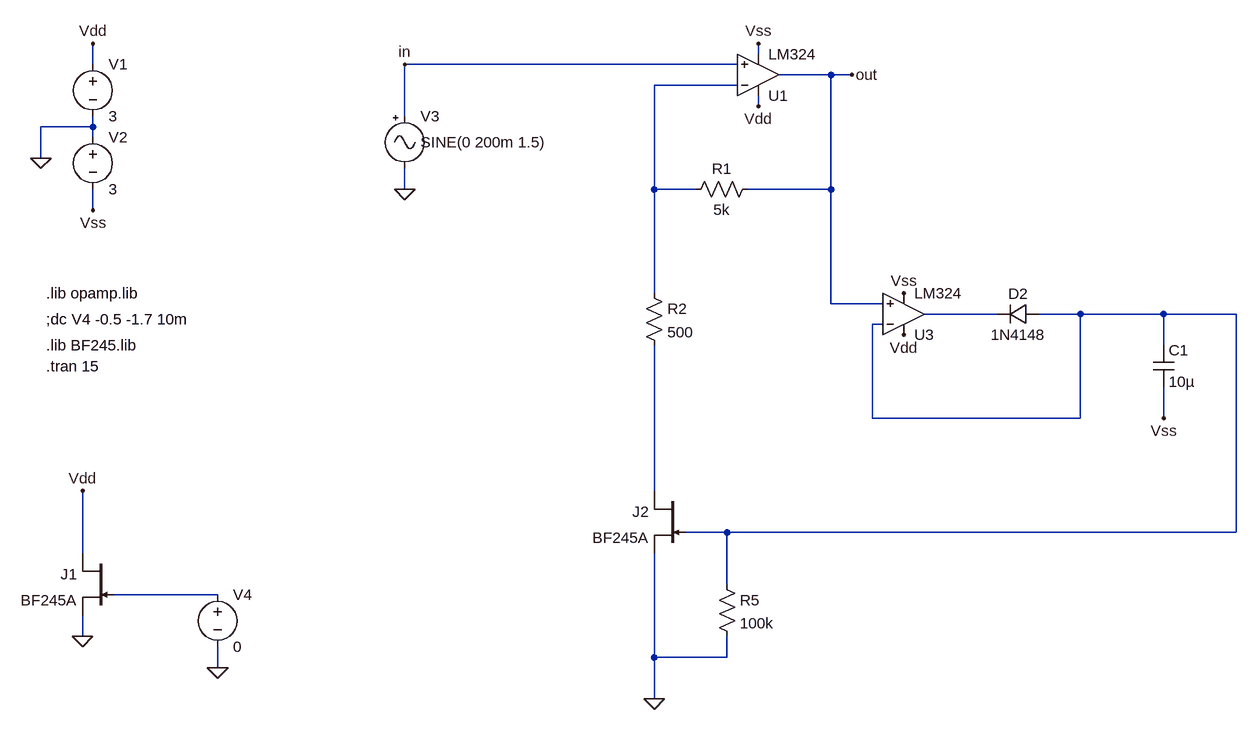
[diagram p0: schematic agc.asc]
agc.asc, the LTspice schematic file:
Version 4
SHEET 1 1464 940
WIRE 224 -176 224 -192
WIRE -800 -160 -800 -192
WIRE 192 -160 -320 -160
WIRE 336 -144 256 -144
WIRE 368 -144 336 -144
WIRE 192 -128 64 -128
WIRE 224 -96 224 -112
WIRE -320 -80 -320 -160
WIRE -800 -64 -800 -80
WIRE -800 -64 -880 -64
WIRE -800 -48 -800 -64
WIRE -880 -16 -880 -64
WIRE -320 32 -320 0
WIRE 64 32 64 -128
WIRE 128 32 64 32
WIRE 336 32 336 -144
WIRE 336 32 208 32
WIRE -800 64 -800 32
WIRE 64 192 64 32
WIRE 336 208 336 32
WIRE 416 208 336 208
WIRE 592 224 480 224
WIRE 720 224 656 224
WIRE 848 224 720 224
WIRE 960 224 848 224
WIRE 416 240 400 240
WIRE 848 272 848 224
WIRE 400 384 400 240
WIRE 720 384 720 224
WIRE 720 384 400 384
WIRE 848 384 848 336
WIRE 64 496 64 272
WIRE 176 560 112 560
WIRE 960 560 960 224
WIRE 960 560 176 560
WIRE -816 592 -816 496
WIRE 176 640 176 560
WIRE -608 656 -768 656
WIRE -816 720 -816 688
WIRE 64 752 64 592
WIRE 176 752 176 720
WIRE 176 752 64 752
WIRE -608 768 -608 736
WIRE 64 816 64 752
FLAG -880 -16 0
FLAG -800 -192 Vdd
FLAG 224 -96 Vdd
FLAG 224 -192 Vss
FLAG -800 64 Vss
FLAG -320 32 0
FLAG 368 -144 out
FLAG -320 -160 in
FLAG -816 720 0
FLAG -816 496 Vdd
FLAG -608 768 0
FLAG 448 192 Vss
FLAG 448 256 Vdd
FLAG 848 384 Vss
FLAG 64 816 0
SYMBOL voltage -800 -176 R0
SYMATTR InstName V1
SYMATTR Value 3
SYMBOL voltage -800 -64 R0
SYMATTR InstName V2
SYMATTR Value 3
SYMBOL Misc\\signal -320 -96 R0
WINDOW 123 24 144 Left 2
WINDOW 39 0 0 Left 2
WINDOW 3 24 56 Left 2
SYMATTR Value SINE(0 200m 1.5)
SYMATTR InstName V3
SYMBOL res 224 16 R90
WINDOW 0 0 56 VBottom 2
WINDOW 3 32 56 VTop 2
SYMATTR InstName R1
SYMATTR Value 5k
SYMBOL njf -768 592 M0
SYMATTR InstName J1
SYMATTR Value BF245A
SYMBOL voltage -608 640 R0
SYMATTR InstName V4
SYMATTR Value 0
SYMBOL Opamps\\opamp2 224 -80 M180
SYMATTR InstName U1
SYMATTR Value LM324
SYMBOL Opamps\\opamp2 448 288 M180
SYMATTR InstName U3
SYMATTR Value LM324
SYMBOL diode 656 208 R90
WINDOW 0 0 32 VBottom 2
WINDOW 3 32 32 VTop 2
SYMATTR InstName D2
SYMATTR Value 1N4148
SYMBOL cap 832 272 R0
SYMATTR InstName C1
SYMATTR Value 10µ
SYMBOL njf 112 496 M0
SYMATTR InstName J2
SYMATTR Value BF245A
SYMBOL res 48 176 R0
SYMATTR InstName R2
SYMATTR Value 500
SYMBOL res 160 624 R0
SYMATTR InstName R5
SYMATTR Value 100k
TEXT -872 232 Left 2 !;dc V4 -0.5 -1.7 10m
TEXT -872 192 Left 2 !.lib opamp.lib
TEXT -872 272 Left 2 !.lib BF245.lib
TEXT -872 304 Left 2 !.tran 15

The netlist it stands for:
* agc.asc
V1 Vdd 0 3
V2 0 Vss 3
V3 in 0 SINE(0 200m 1.5)
R1 out N001 5k
J1 Vdd N005 0 BF245A
V4 N005 0 0
XU1 in N001 Vdd Vss out LM324  ; pins In+ In- V+ V- OUT
XU3 out N003 Vdd Vss N002 LM324  ; pins In+ In- V+ V- OUT
D2 N003 N002 1N4148
C1 N003 Vss 10µ
J2 N004 N003 0 BF245A
R2 N001 N004 500
R5 N003 0 100k
.model D D
.lib standard.dio
.model NJF NJF
.model PJF PJF
.lib standard.jft
;dc V4 -0.5 -1.7 10m
.lib opamp.lib
.lib BF245.lib
.tran 15
.backanno
.end